# Altium schematic sheet Vmux_DataPath.SchDoc
size A3; DocumentNumber: 3; SheetNumber: 3; SheetTotal: 5
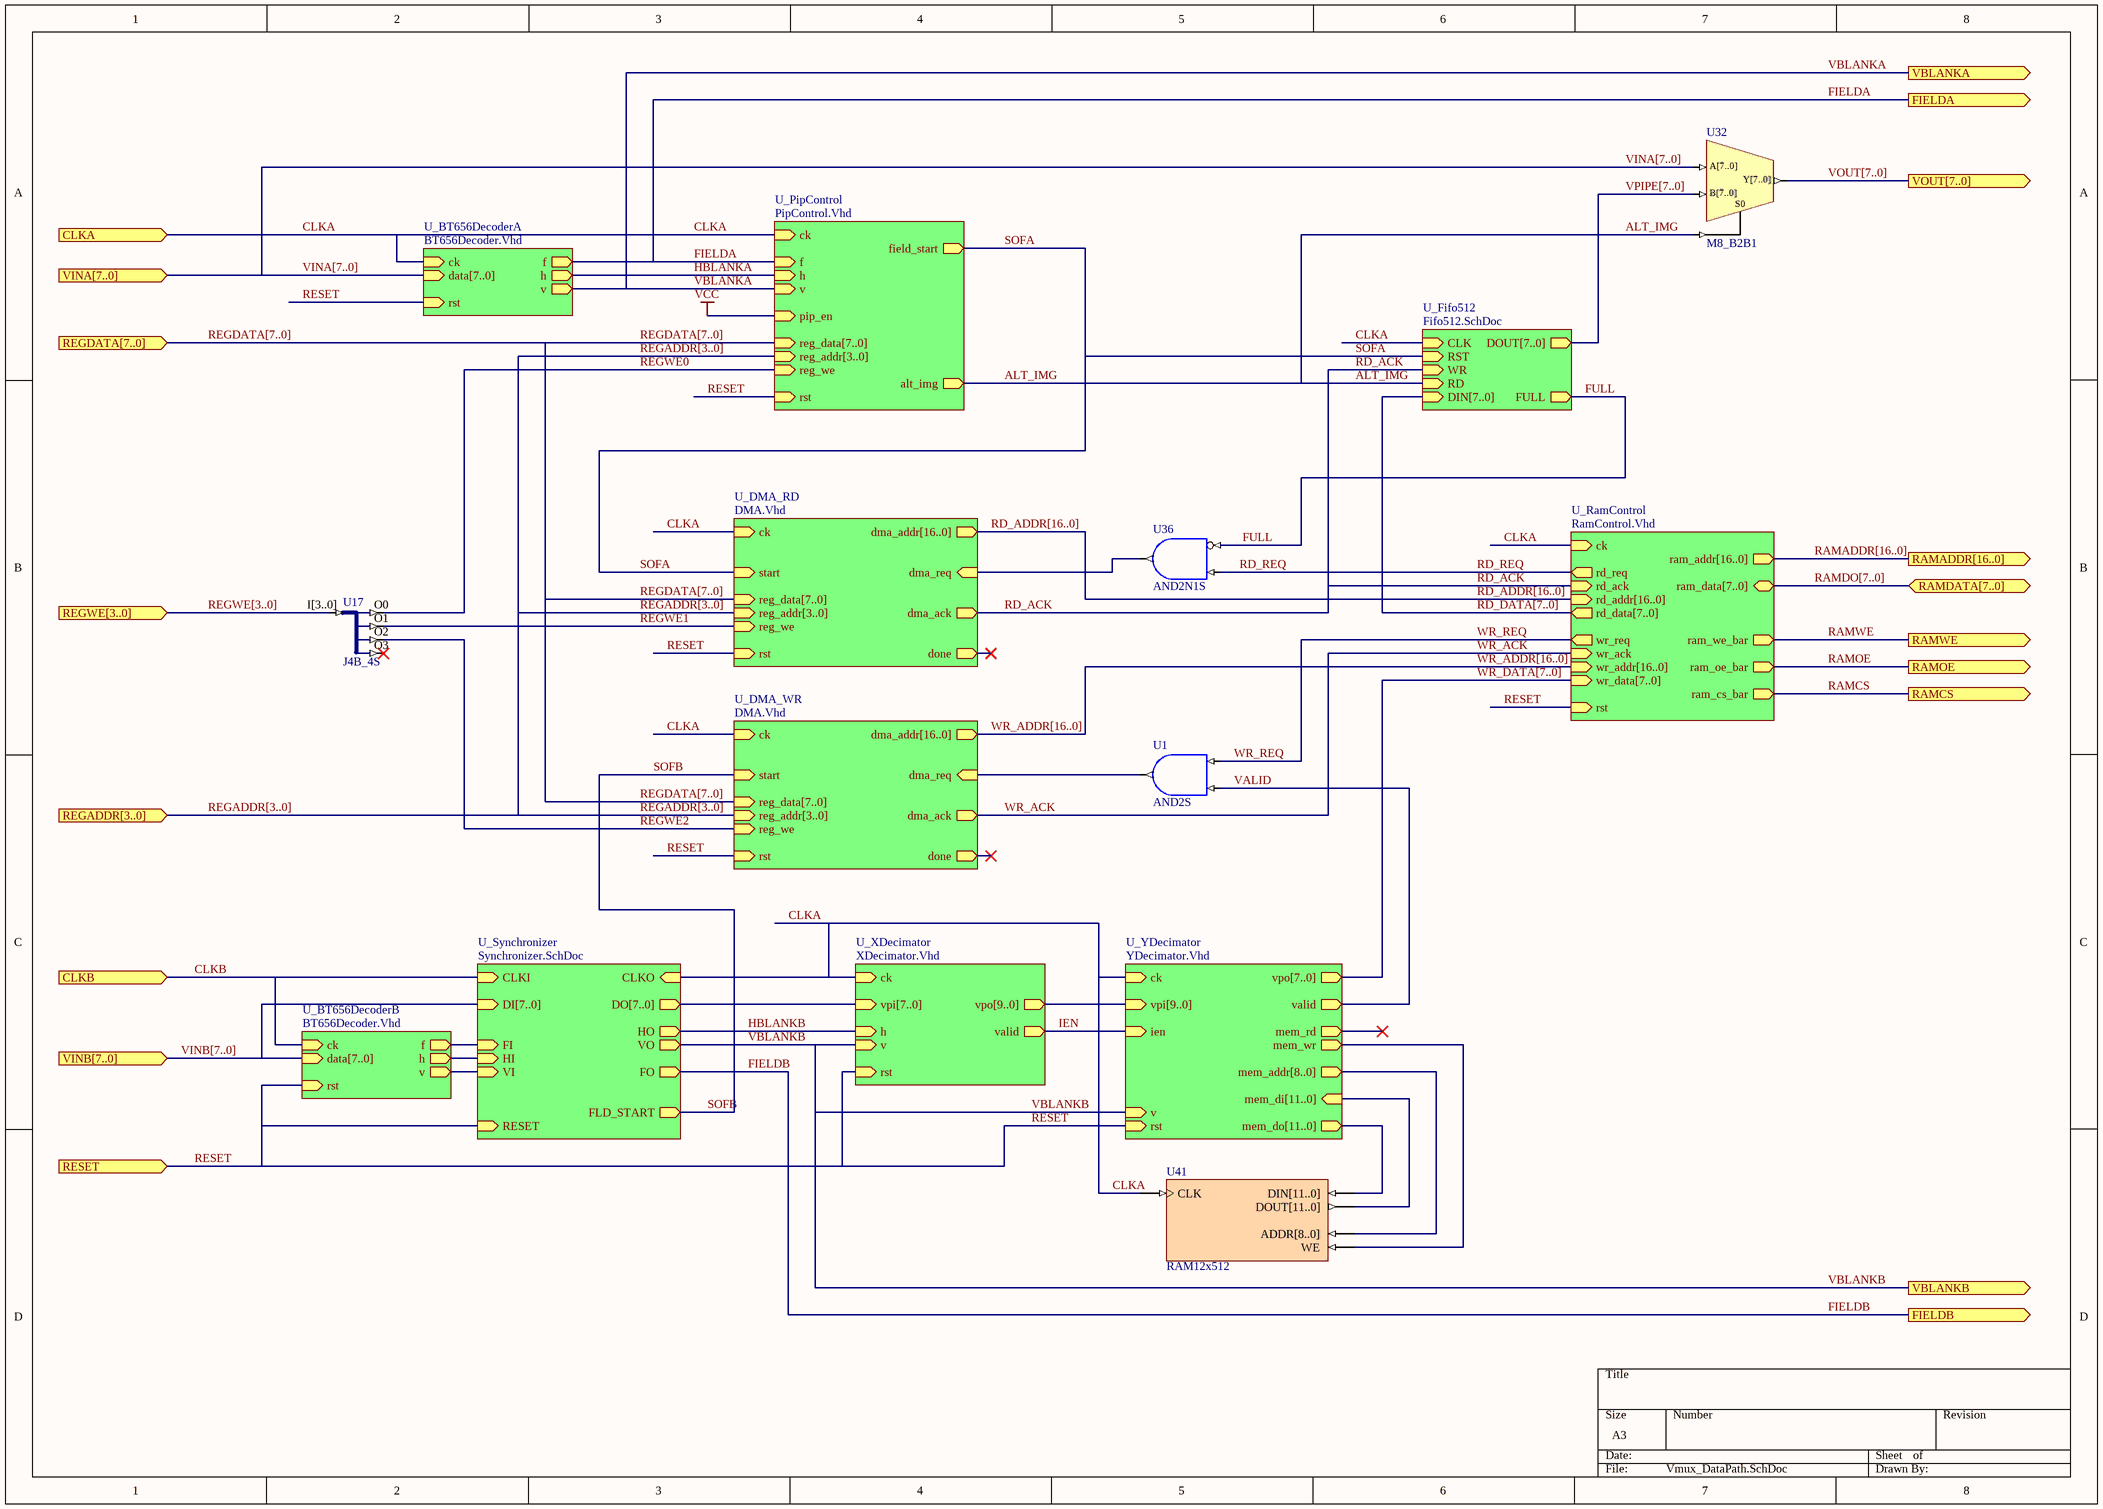
[diagram p0: Vmux_DataPath.SchDoc]

## Parts
U1  AND2S
U17  J4B_4S
U32  M8_B2B1
U36  AND2N1S
U41  RAM12x512

## Sub-sheets
U_BT656DecoderA = BT656Decoder.Vhd: ck (in), data[7..0] (in), f (out), h (out), rst (in), v (out)  | VHDLENTITY: BT656Decoder
U_BT656DecoderB = BT656Decoder.Vhd: ck (in), data[7..0] (in), f (out), h (out), rst (in), v (out)  | VHDLENTITY: BT656Decoder
U_DMA_RD = DMA.Vhd: ck (in), dma_ack (out), dma_addr[16..0] (out), dma_req (in), done (out), reg_addr[3..0] (in), reg_data[7..0] (in), reg_we (in), rst (in), start (in)  | VHDLENTITY: DMA
U_DMA_WR = DMA.Vhd: ck (in), dma_ack (out), dma_addr[16..0] (out), dma_req (in), done (out), reg_addr[3..0] (in), reg_data[7..0] (in), reg_we (in), rst (in), start (in)  | VHDLENTITY: DMA
U_Fifo512 = Fifo512.SchDoc: DOUT[7..0] (out), DIN[7..0] (in), CLK (in), RST (in), WR (in), RD (in), FULL (out)
U_PipControl = PipControl.Vhd: alt_img (out), ck (in), f (in), field_start (out), h (in), pip_en (in), reg_addr[3..0] (in), reg_data[7..0] (in), reg_we (in), rst (in), v (in)  | VHDLENTITY: PipControl
U_RamControl = RamControl.Vhd: ck (in), ram_addr[16..0] (out), ram_cs_bar (out), ram_data[7..0] (bidir), ram_oe_bar (out), ram_we_bar (out), rd_ack (in), rd_addr[16..0] (in), rd_data[7..0] (out), rd_req (out), rst (in), wr_ack (in), wr_addr[16..0] (in), wr_data[7..0] (in), wr_req (out)  | VHDLENTITY: RamControl
U_Synchronizer = Synchronizer.SchDoc: DI[7..0] (in), CLKI (in), HI (in), HO (out), DO[7..0] (out), CLKO (in), RESET (in), FI (in), VI (in), VO (out), FO (out), FLD_START (out)
U_XDecimator = XDecimator.Vhd: ck (in), h (in), rst (in), v (in), valid (out), vpi[7..0] (in), vpo[9..0] (out)  | VHDLENTITY: XDecimator
U_YDecimator = YDecimator.Vhd: ck (in), ien (in), mem_addr[8..0] (out), mem_di[11..0] (in), mem_do[11..0] (out), mem_rd (out), mem_wr (out), rst (in), v (in), valid (out), vpi[9..0] (in), vpo[7..0] (out)  | VHDLENTITY: YDecimator

## Ports
CLKA (in), CLKB (in), FIELDA (out), FIELDB (out), RAMADDR[16..0] (out), RAMCS (out), RAMDATA[7..0] (bidir), RAMOE (out), RAMWE (out), REGADDR[3..0] (in), REGDATA[7..0] (in), REGWE[3..0] (in), RESET (in), VBLANKA (out), VBLANKB (out), VINA[7..0] (in), VINB[7..0] (in), VOUT[7..0] (out)

## Nets
VCC: sheet U_PipControl/pip_en
ALT_IMG: U32.S0 ; sheet U_Fifo512/RD, sheet U_PipControl/alt_img
CLKA: U41.CLK ; port CLKA, sheet U_Fifo512/CLK, sheet U_Synchronizer/CLKO, sheet U_PipControl/ck, sheet U_RamControl/ck, sheet U_XDecimator/ck, sheet U_BT656DecoderA/ck, sheet U_DMA_RD/ck, sheet U_DMA_WR/ck, sheet U_YDecimator/ck
CLKB: port CLKB, sheet U_Synchronizer/CLKI, sheet U_BT656DecoderB/ck
FIELDA: port FIELDA, sheet U_PipControl/f, sheet U_BT656DecoderA/f
FIELDB: port FIELDB, sheet U_Synchronizer/FO
FULL: U36.I0 ; sheet U_Fifo512/FULL
HBLANKA: sheet U_PipControl/h, sheet U_BT656DecoderA/h
HBLANKB: sheet U_Synchronizer/HO, sheet U_XDecimator/h
IEN: sheet U_XDecimator/valid, sheet U_YDecimator/ien
RAMCS: port RAMCS, sheet U_RamControl/ram_cs_bar
RAMOE: port RAMOE, sheet U_RamControl/ram_oe_bar
RAMWE: port RAMWE, sheet U_RamControl/ram_we_bar
RD_ACK: sheet U_Fifo512/WR, sheet U_RamControl/rd_ack, sheet U_DMA_RD/dma_ack
RD_REQ: U36.I1 ; sheet U_RamControl/rd_req
REGWE0: U17.O0 ; sheet U_PipControl/reg_we
REGWE1: U17.O1 ; sheet U_DMA_RD/reg_we
REGWE2: U17.O2 ; sheet U_DMA_WR/reg_we
REGWE[3..0]: U17.I[3..0] ; port REGWE[3..0]
RESET: port RESET, sheet U_Synchronizer/RESET, sheet U_PipControl/rst, sheet U_RamControl/rst, sheet U_XDecimator/rst, sheet U_BT656DecoderA/rst, sheet U_BT656DecoderB/rst, sheet U_DMA_RD/rst, sheet U_DMA_WR/rst, sheet U_YDecimator/rst
SOFA: sheet U_Fifo512/RST, sheet U_PipControl/field_start, sheet U_DMA_RD/start
SOFB: sheet U_Synchronizer/FLD_START, sheet U_DMA_WR/start
VALID: U1.I1 ; sheet U_YDecimator/valid
VBLANKA: port VBLANKA, sheet U_PipControl/v, sheet U_BT656DecoderA/v
VBLANKB: port VBLANKB, sheet U_Synchronizer/VO, sheet U_XDecimator/v, sheet U_YDecimator/v
VINA[7..0]: U32.A[7..0] ; port VINA[7..0], sheet U_BT656DecoderA/data[7..0]
VOUT[7..0]: U32.Y[7..0] ; port VOUT[7..0]
VPIPE[7..0]: U32.B[7..0] ; sheet U_Fifo512/DOUT[7..0]
WR_ACK: sheet U_RamControl/wr_ack, sheet U_DMA_WR/dma_ack
WR_REQ: U1.I0 ; sheet U_RamControl/wr_req
NetU1_O: U1.O ; sheet U_DMA_WR/dma_req
NetU36_O: U36.O ; sheet U_DMA_RD/dma_req
NetU41_ADDR[8..0]: U41.ADDR[8..0] ; sheet U_YDecimator/mem_addr[8..0]
NetU41_DIN[11..0]: U41.DIN[11..0] ; sheet U_YDecimator/mem_do[11..0]
NetU41_DOUT[11..0]: U41.DOUT[11..0] ; sheet U_YDecimator/mem_di[11..0]
NetU41_WE: U41.WE ; sheet U_YDecimator/mem_wr
(unnamed): sheet U_Synchronizer/HI, sheet U_BT656DecoderB/h
(unnamed): sheet U_Synchronizer/FI, sheet U_BT656DecoderB/f
(unnamed): sheet U_Synchronizer/VI, sheet U_BT656DecoderB/v

Not connected (* = marked no-connect by the designer): U17 O3*

## Buses and harness runs
bus RAMADDR[16..0] = port RAMADDR[16..0] = sheet U_RamControl/ram_addr[16..0]
bus RAMDO[7..0] = port RAMDATA[7..0] = sheet U_RamControl/ram_data[7..0]
bus RD_ADDR[16..0] = sheet U_DMA_RD/dma_addr[16..0] = sheet U_RamControl/rd_addr[16..0]
bus RD_DATA[7..0] = sheet U_Fifo512/DIN[7..0] = sheet U_RamControl/rd_data[7..0]
bus REGADDR[3..0] = port REGADDR[3..0] = sheet U_DMA_RD/reg_addr[3..0] = sheet U_DMA_WR/reg_addr[3..0] = sheet U_PipControl/reg_addr[3..0]
bus REGDATA[7..0] = port REGDATA[7..0] = sheet U_DMA_RD/reg_data[7..0] = sheet U_DMA_WR/reg_data[7..0] = sheet U_PipControl/reg_data[7..0]
bus REGWE[3..0] = port REGWE[3..0]
bus sheet U_Synchronizer/DO[7..0] = sheet U_XDecimator/vpi[7..0]
bus sheet U_XDecimator/vpo[9..0] = sheet U_YDecimator/vpi[9..0]
bus VINA[7..0] = port VINA[7..0] = sheet U_BT656DecoderA/data[7..0]
bus VINB[7..0] = port VINB[7..0] = sheet U_BT656DecoderB/data[7..0] = sheet U_Synchronizer/DI[7..0]
bus VOUT[7..0] = port VOUT[7..0]
bus VPIPE[7..0] = sheet U_Fifo512/DOUT[7..0]
bus WR_ADDR[16..0] = sheet U_DMA_WR/dma_addr[16..0] = sheet U_RamControl/wr_addr[16..0]
bus WR_DATA[7..0] = sheet U_RamControl/wr_data[7..0] = sheet U_YDecimator/vpo[7..0]

## Library data of the parts
U1 = AND2S: 2-Input AND Gate, Single Pin Version; Xilinx Equivalent: AND2; ArchiveName: GENERIC; Published: 18-Nov-2003; Publisher: Altium Limited; Core Revision: 1.00.00
U17 = J4B_4S: 4-Bit input bus to 4 Single pin outputs; ArchiveName: GENERIC; Published: 18-Nov-2003; Publisher: Altium Limited; Core Revision: 1.00.00
U32 = M8_B2B1: 2x8-Bit Bus to 1x8-Bit Bus Multiplexer; ArchiveName: GENERIC; Published: 18-Nov-2003; Publisher: Altium Limited; Core Revision: 1.00.00
U36 = AND2N1S: 2-Input AND Gate with Active Low A Input, Single Pin Version; Xilinx Equivalent: AND2B1; ArchiveName: GENERIC; Published: 18-Nov-2003; Publisher: Altium Limited; Core Revision: 1.00.00
U41 = RAM12x512: Single Port Random Access Memory 512 x 12; Memory_Depth: 512; Memory_Type: RAM_SinglePortBlock; Memory_Width: 12; Memory_ClockEdge: Rising; Nexus_Core: Memory_Program; Published: 26/09/2003; Publisher: Altium Hobart Technology Center